# Altium schematic sheet Sheet2.SchDoc
size A4; SheetNumber: 2; SheetTotal: 3
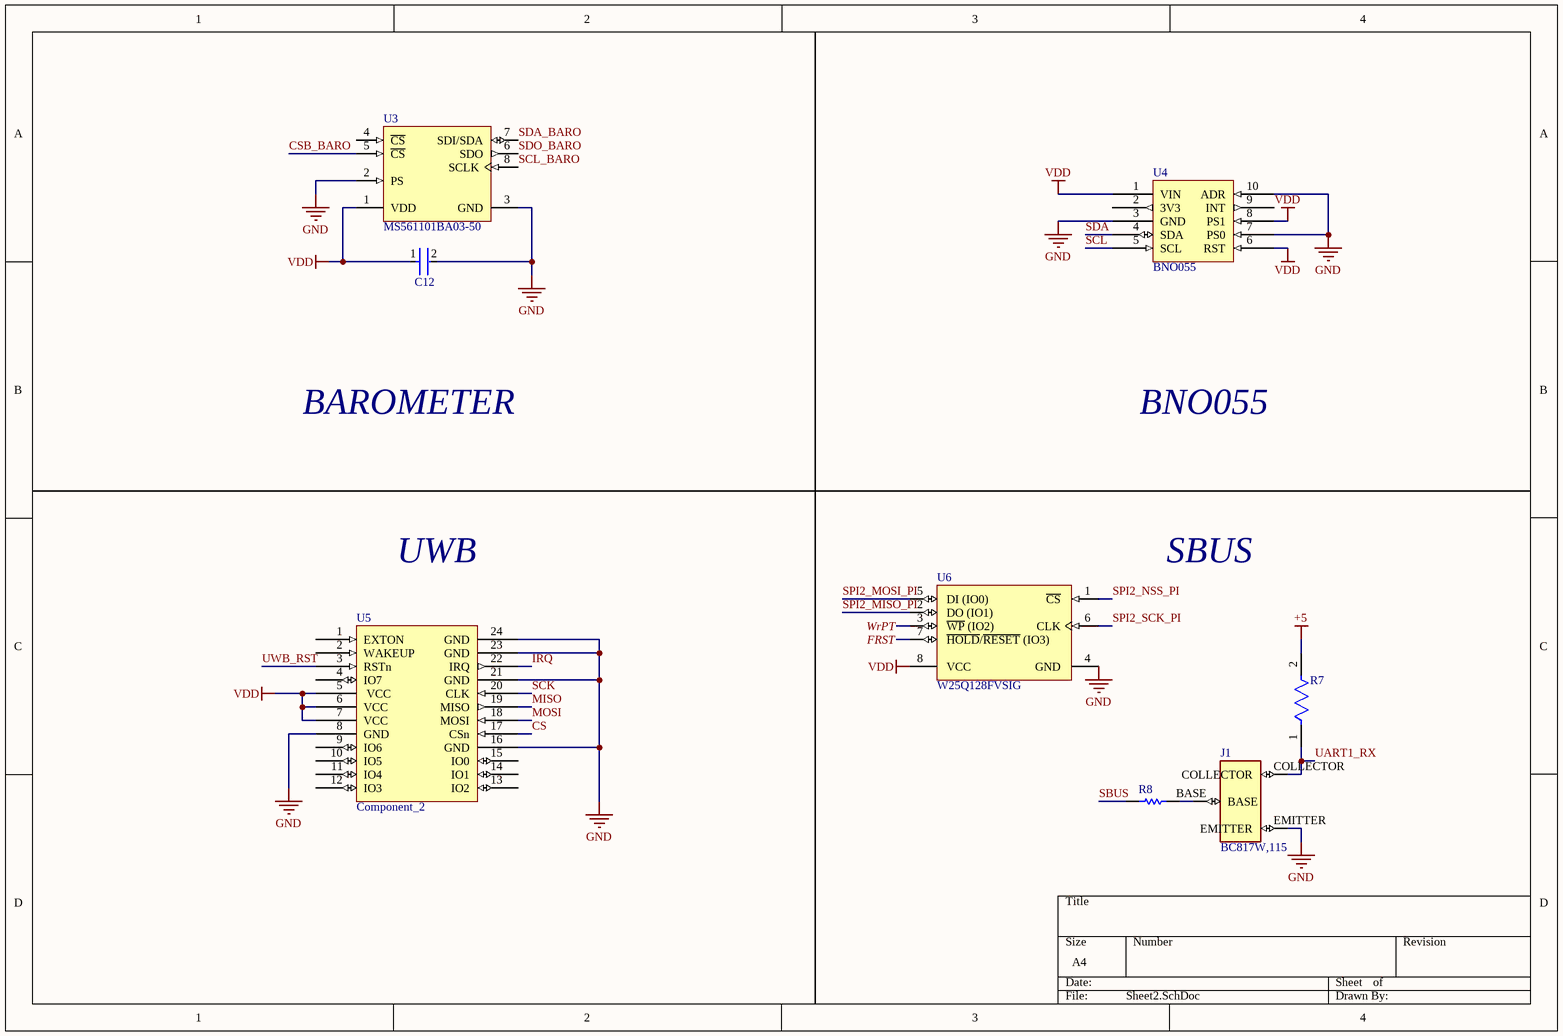
[diagram p0: Sheet2.SchDoc]

## Parts
C12  C0603C104K4RACTU  [FP-C0603C-CF-MFG]  (value not drawn)
J1  BC817W,115  [SOT323]
R7  MCT06030C1002FP500  [FP-MCT0603-IPC_C]  (value not drawn)
R8  RC0603JR-074K7L  [RESC1608X55X25ML10T15]  (value not drawn)
U3  MS561101BA03-50  [MSI-MS561101BA03-50-8_V]
U4  BNO055  [BNO055_MOD]
U5  Component_2  [BU01]
U6  W25Q128FVSIG  [WINB-SOIC-8_M]

## Nets
+5: R7.2
GND: C12.2 J1.EMITTER U3.2(PS) U3.3(GND) U4.3(GND) U4.7(PS0) U4.10(ADR) U5.8(GND) U5.16(GND) U5.21(GND) U5.23(GND) U5.24(GND) U6.4(GND)
VDD: C12.1 U3.1(VDD) U4.1(VIN) U4.6(RST) U4.8(PS1) U5.5(VCC) U5.6(VCC) U5.7(VCC) U6.8(VCC)
CS: U5.17(CSn)
CSB_BARO: U3.5(~{CS})
FRST: U6.7(~{HOLD}/~{RESET}_(IO3))
IRQ: U5.22(IRQ)
MISO: U5.19(MISO)
MOSI: U5.18(MOSI)
SBUS: R8.1
SCK: U5.20(CLK)
SCL: U4.5(SCL)
SCL_BARO: U3.8(SCLK)
SDA: U4.4(SDA)
SDA_BARO: U3.7(SDI/SDA)
SDO_BARO: U3.6(SDO)
SPI2_MISO_PI: U6.2(DO_(IO1))
SPI2_MOSI_PI: U6.5(DI_(IO0))
SPI2_NSS_PI: U6.1(~{CS})
SPI2_SCK_PI: U6.6(CLK)
UART1_RX: J1.COLLECTOR R7.1
UWB_RST: U5.3(RSTn)
WrPT: U6.3(~{WP}_(IO2))
NetJ1_BASE: J1.BASE R8.2

Not connected (* = marked no-connect by the designer): U3 4(~{CS}); U4 2(3V3) 9(INT); U5 1(EXTON) 2(WAKEUP) 4(IO7) 9(IO6) 10(IO5) 11(IO4) 12(IO3) 13(IO2) 14(IO1) 15(IO0)

## Notes on the sheet
- BAROMETER
- BNO055
- UWB
- SBUS

## Library data of the parts
C12 = CMP-2006-03811-3: Capacitor; Ceramic; Cap; .100uF; Tol 10%; SMT; Vol-Rtg 16V; X7R; Tape and Reel; Manufacturer: KEMET; Value: 0.10 μF; Temperature Coefficient: 30ppm/°C; Automotive Grade: Grade 1; Tolerance: 0.1; Digikey Description: Capacitor; Ceramic; Cap; .100uF; Tol 10%; SMT; Vol-Rtg 16V; X7R; Tape and Reel; Automotive: Yes; Temperature Range High: +125°C; Device Class L1: Passive Components; Material: Ceramic; Lead Free: Yes; Device Class L2: Capacitors; Capacitance: 0.10 μF; Height: 0.87mm; Voltage Rating: 16 V; Manufacturer Part Number: C0603C104K4RACTU; Octopart: https://octopart.com/c0603c104k4ractu-kemet-93067; Package: C0603C-CF; Temperature Characteristic: X7R; Device Class L3: Ceramic Capacitors; ComponentLink2URL: https://api.kemet.com/component-edge/download/datasheet/C0603C100J5GACAUTO.pdf; Temperature Range Low: -55°C; ComponentLink2Description: Datasheet; Mouser Description: Multilayer Ceramic Capacitors MLCC - SMD/SMT 16volts 0.1uF 10% X7R 10%; RoHS: TRUE; Temperature: -55°C to +125°C; Category: Cap
J1 = BC817W,115: Bipolar (BJT) Transistor NPN 45 V 500 mA 100MHz 200 mW Surface Mount SOT-323; MF: Nexperia USA; Purchase-URL: https://pricing.snapeda.com/search/part/BC817W,115/?ref=eda; Package: SC-70-3 Nexperia USA Inc.; SnapEDA_Link: https://www.snapeda.com/parts/BC817W,115/Nexperia/view-part/?ref=snap; Availability: In Stock; Value: *; MP: BC817W,115; Check_prices: https://www.snapeda.com/parts/BC817W,115/Nexperia/view-part/?ref=eda; Price: None
R7 = CMP-02407-000418-1: RES SMD 100 OHM 1% 1/8W 0603; Voltage Rating: 75V; Power Rating: 100mW; Temperature Coefficient: 50ppm/°C; Max Power Dissipation: 125mW; Resistance: 10kR; Case/Package: 0603; Military Standard: Not; Min Operating Temperature: -55°C; Width: 0.8mm; Package Quantity: 1; Max Operating Temperature: 125°C; Tolerance: 1%; Depth: 0.85mm; Radiation Hardening: No; Mount: Surface Mount; Composition: Thin Film; Contact Plating: Tin; Lead Free: Lead Free; Case Code (Imperial): 0603; Number of Terminations: 2; Voltage Rating (DC): 75V; Length: 1.55mm; Packaging: Tape and Reel; Height: 0.022inch; Case Code (Metric): 1608
R8 = CMP-2000-05024-1: Chip Resistor, 4.7 KOhm, +/- 5%, 100 mW, -55 to 155 degC, 0603 (1608 Metric), RoHS, Tape and Reel; Manufacturer: Yageo; Resistance: 4.7kOhms; Temperature Coefficient: 100PPM/C; Power Rating: 100mW; Voltage Rating: 50V; Operating Temperature Range: -55Cto+155C; Case Code - mm: 1608; Tolerance: 5%; Product: ThickFilmResistorsGeneralPurpose; Case Code - in: 0603; Datasheet URL: http://www.yageo.com/documents/recent/PYu-RC_Group_51_RoHS_L_04.pdf; Package Reference: 603; Datasheet Version: Rev. 4, 02/2016; Package Description: 2-Pin Surface Mount Device, Body 1.6 x 0.8 mm; Manufacturer URL: http://www.yageo.com/; Series: RC; Packaging: Reel; Termination Style: SMD/SMT
U3 = CMP-2000-05251-1: Barometric Pressure Sensor, with Stainless Steel Cap, 1.8 to 3.6 V, -45 to 85 degC, 8-Pin QFN, RoHS, Tape and Reel; Manufacturer: Measurement Specialties; Operating Pressure Max: 1200mbar; Supply Current: 12.5µA; Supply Voltage Max: 3.6V; Supply Voltage Min: 1.8V; No. of Pins: 8; Connection Size: 0.5mm; SVHC: NoSVHC(20-Jun-2013); Operating Pressure Min: 10mbar; Manufacturer URL: http://www.meas-spec.com/; Operating Temperature Min: -40degC; Pressure Type: Barometric; Package Reference: MS561101BA03-50-8; Datasheet URL: http://www.te.com/commerce/DocumentDelivery/DDEController?Action=srchrtrv&DocNm=MS5611-01BA03&DocType=Data+Sheet&DocLang=English&DocFormat=pdf&PartCntxt=CAT-BLPS0036; Package Description: 8-Pin Surface Mount Device, Body 5 x 3 mm, Pitch 1.25 mm; Sensor Case Style: QFN; Datasheet Version: Sep-15; Operating Temperature Max: 85degC
U4 = Component_1
U6 = CMP-2000-05005-1: 3V 128M-Bit Serial Flash Memory with Dual/Quad SPI & QPI, 2.7 to 3.6 V, -40 to 85 degC, 8-Pin SOIC, RoHS, Tape and Reel; Manufacturer: Winbond; Number of Words: 16777216; Address Bus: 24b; Word Size: 8b; Boot Type: NotRequired; Supply Current: 20mA; Operating Supply Voltage (Max): 3.6V; Sync/Async: Synchronous; Rad Hardened: No; Interface Type: Serial(SPI); Access Time (Max): 7ns; Operating Supply Voltage (Min): 2.7V; Operating Supply Voltage (Typ): 3/3.3V; Programmable: Yes; Density: 134217728Bit; Cell Type: NOR; Package Description: 8-Pin Small Outline Integrated Circuit, Body 5.28 x 5.28 mm, Pitch 1.27 mm; Datasheet URL: http://download.siliconexpert.com/pdfs/2015/11/30/6/42/17/890/win_/manual/3w25q128fv20rev.l2008242015.pdf; Package Reference: SS-8; Package Type: SOICW; Datasheet Version: Rev. L, 08/2015; Manufacturer URL: http://www.winbond.com/hq/index.html?__locale=en; Pin Count: 8; Operating Temperature Classification: Industrial; Operating Temperature (Min): -40C; Program/Erase Volt (Typ): 2.7to3.6V; Operating Temperature (Max): 85C; Mounting: SurfaceMount; Operating Temp Range: -40Cto85C